# EAGLE design main1 (EAGLE 9.2.2)
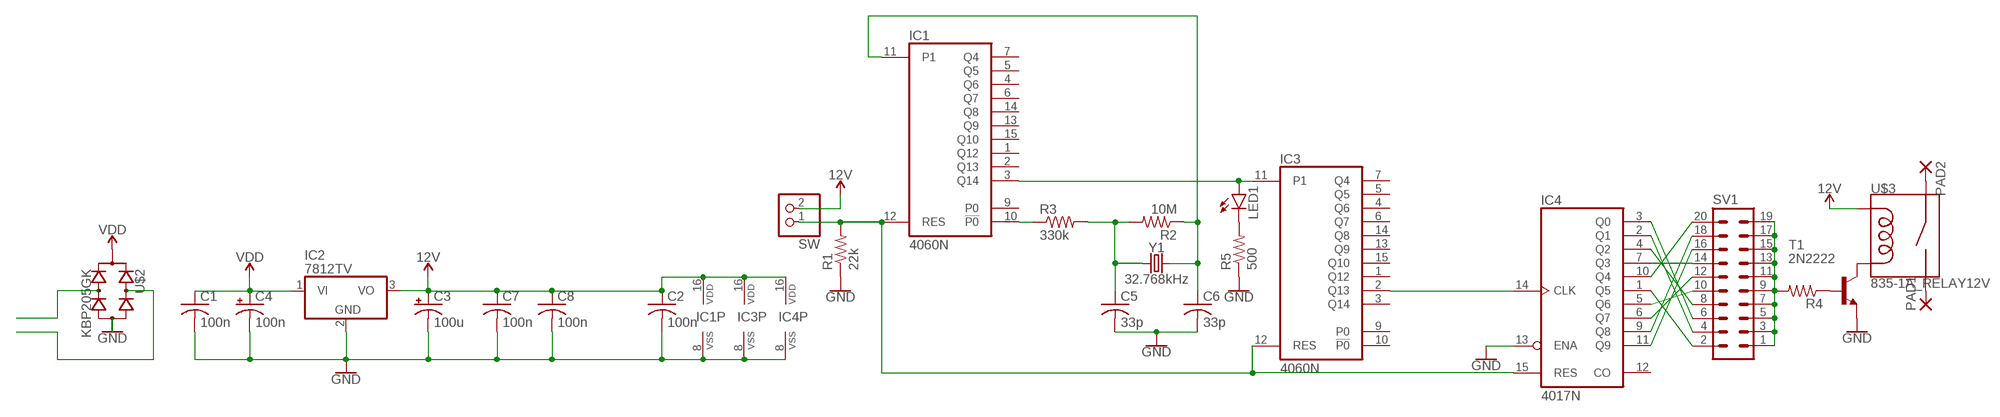
[diagram p0: schematic, sheet 1]

## Parts
C1  100n  C-US025-025X050  [C025-025X050]
C2  100n  C-US025-025X050  [C025-025X050]
C3  100u  CPOL-USE2-5  [E2-5]
C4  100n  CPOL-USE2-5  [E2-5]
C5  33p  C-US025-025X050  [C025-025X050]
C6  33p  C-US025-025X050  [C025-025X050]
C7  100n  C-US025-025X050  [C025-025X050]
C8  100n  C-US025-025X050  [C025-025X050]
IC1  4060N  [DIL16]
IC2  7812TV  [TO220V]
IC3  4060N  [DIL16]
IC4  4017N  [DIL16]
LED1  LED3MM  [LED3MM]
PAD1  2,54/1,0  [2,54/1,0]
PAD2  2,54/1,0  [2,54/1,0]
R1  22k  R-US_0207/7  [0207/7]
R2  10M  R-US_0207/7  [0207/7]
R3  330k  R-US_0207/7  [0207/7]
R4  R-US_0207/2V  [0207/2V]
R5  500  R-US_0207/7  [0207/7]
SV1  MA10-2  [MA10-2]
SW  PINHD-1X2  [1X02]
T1  2N2222  [TO92-EBC-OVAL]
U$2  KBP205GK  [KBP205G]
U$3  835-1A_RELAY12V  [835-1A_RELAY_12V]
Y1  32.768kHz  CRYSTAL-32.768KHZPTH-2X6  [CRYSTAL-PTH-2X6-CYL]

## Nets
12V: C2.1 C3.+ C7.1 C8.1 IC1.16(VDD) IC2.3(VO) IC3.16(VDD) IC4.16(VDD) SW.2 U$3.P$1(COIL1)
GND: C1.2 C2.2 C3.- C4.- C5.2 C6.2 C7.2 C8.2 IC1.8(VSS) IC2.2(GND) IC3.8(VSS) IC4.8(VSS) IC4.13(ENA) R1.1 R5.1 T1.E U$2.-
N$1: U$2.AC@2(AC)
N$2: U$2.AC@1(AC)
N$3: IC1.12(RES) IC3.12(RES) IC4.15(RES) R1.2 SW.1
N$4: IC1.10(!P0) R3.1
N$5: C6.1 IC1.11(P1) R2.1 Y1.2
N$6: IC1.3(Q14) IC3.11(P1) LED1.A
N$7: C5.1 R2.2 R3.2 Y1.1
N$8: IC3.2(Q13) IC4.14(CLK)
N$9: IC4.11(Q9) SV1.16
N$10: IC4.9(Q8) SV1.18
N$11: IC4.6(Q7) SV1.12
N$12: IC4.5(Q6) SV1.10
N$13: IC4.1(Q5) SV1.2
N$14: IC4.10(Q4) SV1.20
N$15: IC4.7(Q3) SV1.14
N$16: IC4.4(Q2) SV1.8
N$17: IC4.2(Q1) SV1.4
N$18: IC4.3(Q0) SV1.6
N$19: R4.2 SV1.1 SV1.3 SV1.5 SV1.7 SV1.9 SV1.11 SV1.13 SV1.15 SV1.17 SV1.19
N$20: R4.1 T1.B
N$21: T1.C U$3.P$2(COIL2)
N$22: LED1.K(C) R5.2
N$23: PAD1.1(P) U$3.P$4(NO)
N$24: PAD2.1(P) U$3.P$3(MAIN)
VDD: C1.1 C4.+ IC2.1(VI) U$2.+
Unconnected: IC1.1(Q12) IC1.2(Q13) IC1.4(Q6) IC1.5(Q5) IC1.6(Q7) IC1.7(Q4) IC1.9(P0) IC1.13(Q9) IC1.14(Q8) IC1.15(Q10) IC3.1(Q12) IC3.3(Q14) IC3.4(Q6) IC3.5(Q5) IC3.6(Q7) IC3.7(Q4) IC3.9(P0) IC3.10(!P0) IC3.13(Q9) IC3.14(Q8) IC3.15(Q10) IC4.12(CO)

## Library data of the parts
C1 C2 C5-C8 = rcl:C-US: CAPACITOR, American symbol; SPICEPREFIX: C
C3 C4 = rcl:CPOL-US: POLARIZED CAPACITOR, American symbol; SPICEPREFIX: C
IC1 IC3 = 40xx:4060: 14-stage binary/ripple COUNTER
IC2 = linear:78*: Positive VOLTAGE REGULATOR Source: http://cache.national.com/ds/LM/LM78L05.pdf http://www.fairchildsemi.com/ds/LM/LM7805.pdf
IC4 = 40xx:4017: COUNTER/DIVIDER
LED1 = led:LED: LED OSRAM: - CHIPLED LG R971, LG N971, LY N971, LG Q971, LY Q971, LO R971, LY R971 LH N974, LH R974 LS Q976, LO Q976, LY Q976 LO Q996 - Hyper CHIPLED LW Q18S LB Q993, LB Q99A, LB R99A - SideLED LS A670, LO A670, LY A670, LG A670, LP A670 LB A673, LV A673, LT A673, LW A673 LH A674 LY A675 LS A676, LA A676, LO A676, LY A676, LW A676 LS A679, LY A679, LG A679 - Hyper Micro SIDELED® LS Y876, LA Y876, LO Y876, LY Y876 LT Y87S - SmartLED LW L88C, LW L88S LB L89C, LB L89S, LG L890 LS L89K, LO L89K, LY L89K LS L896, LA L896, LO L896, LY L896 - TOPLED LS T670, LO T670, LY T670, LG T670, LP T670 LSG T670, LSP T670, LSY T670, LOP T670, LYG T670 LG T671, LOG T671, LSG T671 LB T673, LV T673, LT T673, LW T673 LH T674 LS T676, LA T676, LO T676, LY T676, LB T676, LH T676, LSB T676, LW T676 LB T67C, LV T67C, LT T67C, LS T67K, LO T67K, LY T67K, LW E67C LS E67B, LA E67B, LO E67B, LY E67B, LB E67C, LV E67C, LT E67C LW T67C LS T679, LY T679, LG T679 LS T770, LO T770, LY T770, LG T770, LP T770 LB T773, LV T773, LT T773, LW T773 LH T774 LS E675, LA E675, LY E675, LS T675 LS T776, LA T776, LO T776, LY T776, LB T776 LHGB T686 LT T68C, LB T68C - Hyper Mini TOPLED® LB M676 - Mini TOPLED Santana® LG M470 LS M47K, LO M47K, LY M47K Source: http://www.osram.convergy.de LUXEON: - LUMILED® LXK2-PW12-R00, LXK2-PW12-S00, LXK2-PW14-U00, LXK2-PW14-V00 LXK2-PM12-R00, LXK2-PM12-S00, LXK2-PM14-U00 LXK2-PE12-Q00, LXK2-PE12-R00, LXK2-PE12-S00, LXK2-PE14-T00, LXK2-PE14-U00 LXK2-PB12-K00, LXK2-PB12-L00, LXK2-PB12-M00, LXK2-PB14-N00, LXK2-PB14-P00, LXK2-PB14-Q00 LXK2-PR12-L00, LXK2-PR12-M00, LXK2-PR14-Q00, LXK2-PR14-R00 LXK2-PD12-Q00, LXK2-PD12-R00, LXK2-PD12-S00 LXK2-PH12-R00, LXK2-PH12-S00 LXK2-PL12-P00, LXK2-PL12-Q00, LXK2-PL12-R00 Source: www.luxeon.com KINGBRIGHT: KA-3528ASYC Source: www.kingbright.com
PAD1 PAD2 = 7_segment_lib:2,54/1,0: THROUGH-HOLE PAD
R1-R5 = rcl:R-US_: RESISTOR, American symbol; SPICEPREFIX: R
SV1 = con-lstb:MA10-2: PIN HEADER; OC_FARNELL: unknown; OC_NEWARK: unknown
SW = pinhead:PINHD-1X2: PIN HEADER
T1 = adafruit:2N2222: NPN TRANSISTOR Big oval pads
U$2 = 7_segment_lib:KBP205G
U$3 = 7_segment_lib:835-1A_RELAY12V
Y1 = SparkFun-Clocks:CRYSTAL-32.768KHZ: 32.768kHz Crystal Frequency: 32.768kHz Frequency Stability: ±20ppm Load Capacitance: 12.5pF (PTH-2X6 & SMD-3.2X1.5), 6pF (SMD-2X6) SparkFun Products: SparkFun BigTime Watch Kit <https://www.sparkfun.com/products/11734> SparkFun nRF52832 Breakout <https://www.sparkfun.com/products/13990> SparkFun Real Time Clock Module <https://www.sparkfun.com/products/12708>; PROD_ID: XTAL-10112

## Board
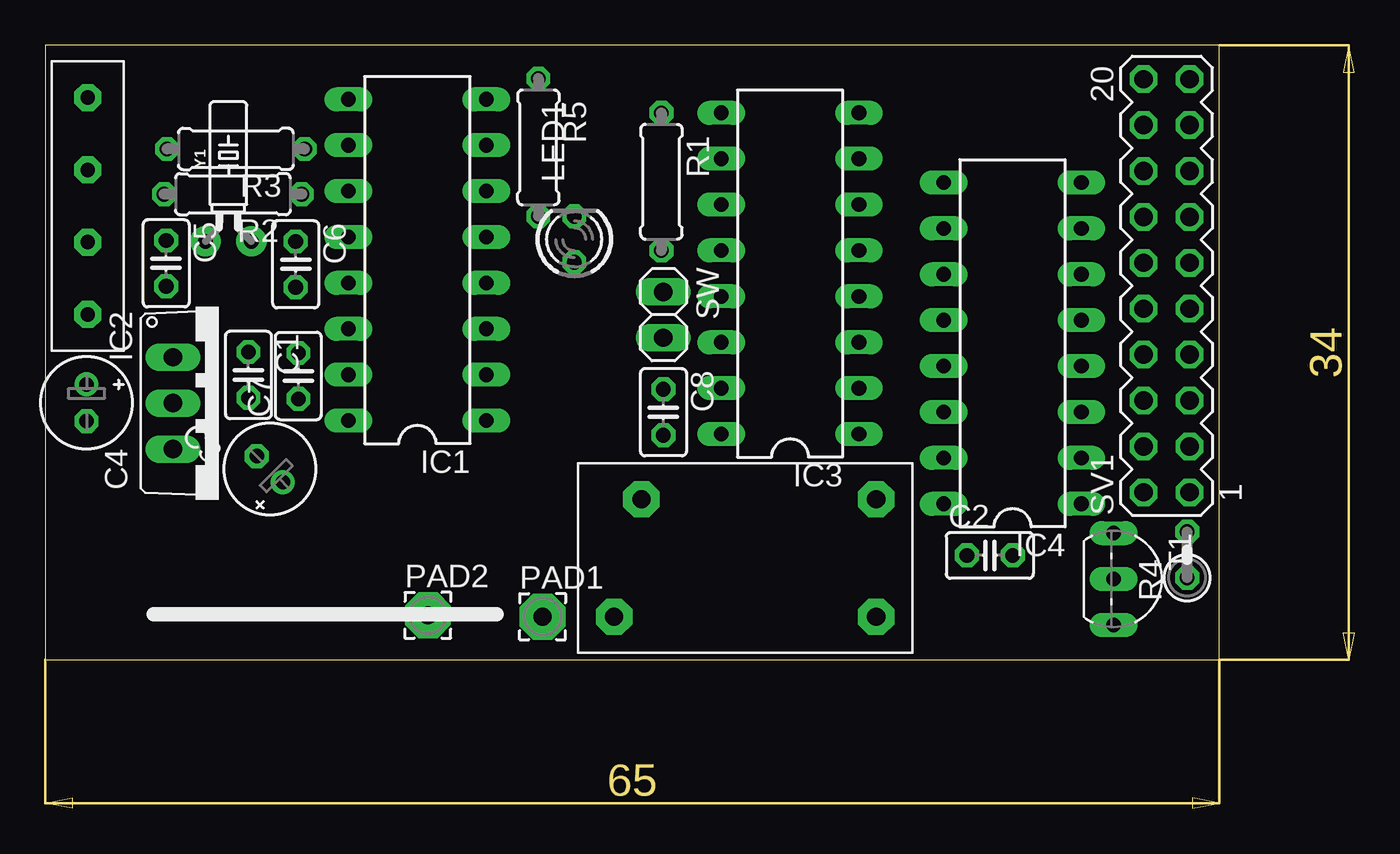
[diagram p1: board, top side]
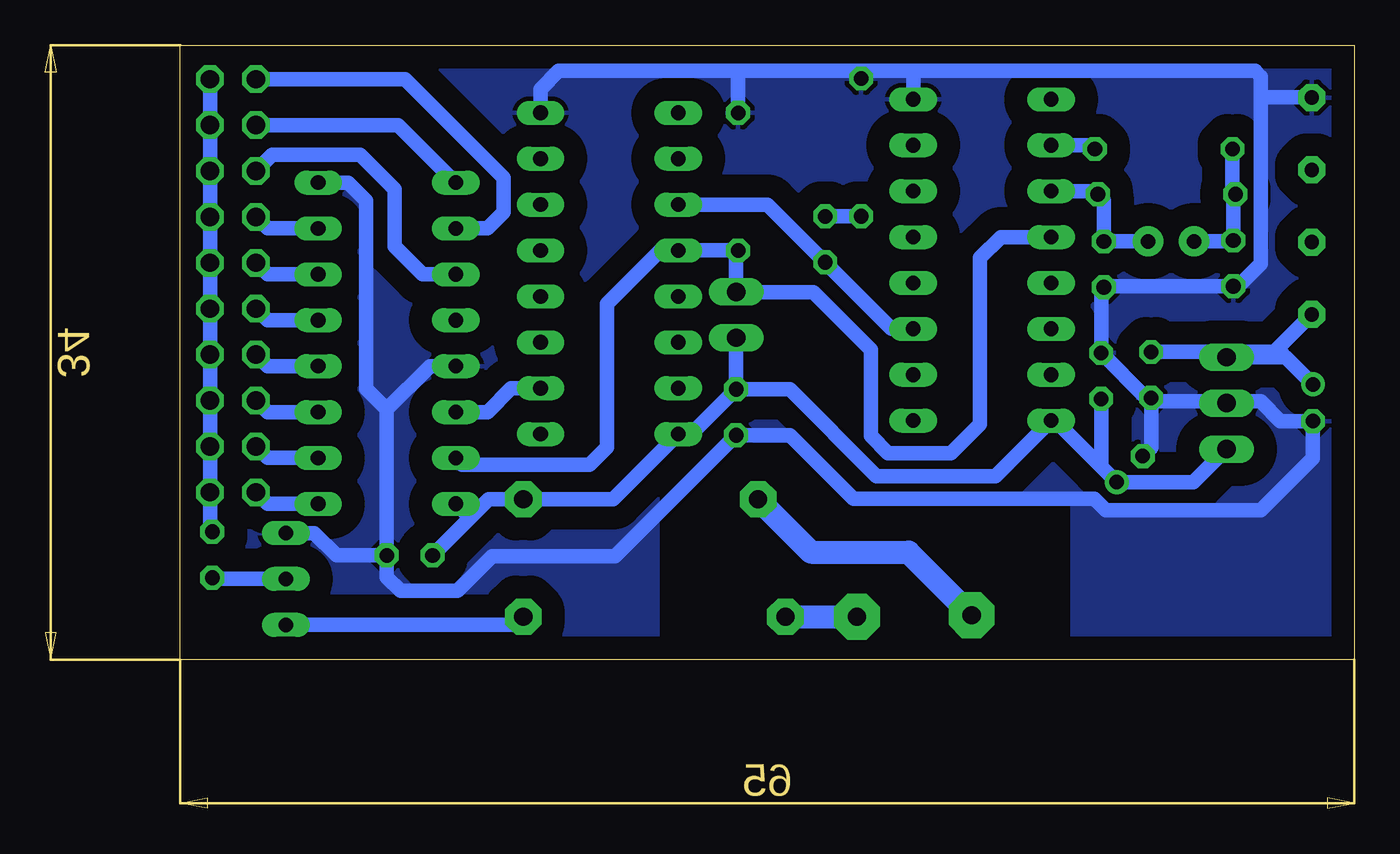
[diagram p2: board, bottom side, seen from below]

Size 65 x 34 mm. Coordinates in mm from the lower left corner, seen from the top.
Outline: 0,0 65,0 65,34 0,34 0,0
Copper layers (1*16): Top 0.035mm / dielectric 1.5mm / Bottom 0.035mm
Design rules "default": minimum track width 6mil, minimum drill 0.35mm, track to track 6mil, track to pad 6mil, pad to pad 6mil, via to via 6mil, smd to smd 6mil, copper to edge 40mil, drill to drill 6mil, minimum pad ring 10mil, minimum via ring 8mil, stop-mask expansion 4mil, vias tented up to drill 0mil, thermal gap 10mil

### Footprints (pad centres in the part's own frame; a part is rotated, then mirrored left to right if it is on the bottom)
C025-025X050 = drill 0.813 octagon: 1 -1.27,0; 2 1.27,0
E2-5 = drill 0.813 pad 1.27: + -1.016,0 | drill 0.813 pad 1.27 octagon: - 1.016,0
DIL16 = drill 0.813 long: 1 -8.89,-3.81; 2 -6.35,-3.81; 3 -3.81,-3.81; 4 -1.27,-3.81; 5 1.27,-3.81; 6 3.81,-3.81; 7 6.35,-3.81; 8 8.89,-3.81; 9 8.89,3.81; 10 6.35,3.81; 11 3.81,3.81; 12 1.27,3.81; 13 -1.27,3.81; 14 -3.81,3.81; 15 -6.35,3.81; 16 -8.89,3.81
TO220V = drill 1.016 long: 1 -2.54,-2.54; 2 0,-2.54; 3 2.54,-2.54
LED3MM = drill 0.813 octagon: A -1.27,0; K 1.27,0
2,54/1,0 = drill 1.016 pad 2.54 octagon: 1 0,0
0207/7 = drill 0.813 octagon: 1 -3.81,0; 2 3.81,0
0207/2V = drill 0.813 octagon: 1 -1.27,0; 2 1.27,0
MA10-2 = drill 1.016 octagon: 1 -11.43,-1.27; 2 -11.43,1.27; 3 -8.89,-1.27; 4 -8.89,1.27; 5 -6.35,-1.27; 6 -6.35,1.27; 7 -3.81,-1.27; 8 -3.81,1.27; 9 -1.27,-1.27; 10 -1.27,1.27; 11 1.27,-1.27; 12 1.27,1.27; 13 3.81,-1.27; 14 3.81,1.27; 15 6.35,-1.27; 16 6.35,1.27; 17 8.89,-1.27; 18 8.89,1.27; 19 11.43,-1.27; 20 11.43,1.27
1X02 = drill 1.016 long: 1 -1.27,0; 2 1.27,0
TO92-EBC-OVAL = drill 0.813 long: B 0,-1.27; C 2.54,-1.27; E -2.54,-1.27
KBP205G = drill 0.8 pad 1.5 octagon: + 0,0; - 12,0; AC@1 4,0; AC@2 8,0
835-1A_RELAY_12V = drill 1 pad 2 octagon: P$1 8.5,2; P$2 2,2; P$3 8.5,15; P$4 2,16.5
CRYSTAL-PTH-2X6-CYL = drill 0.813 pad 1.676: 1 -1.27,0; 2 1.27,0

### Placement (x,y rotation side)
C1  11.25,15.75 270 top
C2  52.29,5.77 0 top
C3  12.43,10.54 135 top
C4  2.29,14.21 270 top
C5  6.7,21.93 270 top
C6  13.87,21.87 270 top
C7  14.01,15.7 90 top
C8  34.22,13.69 270 top
IC1  20.6,22.11 90 top
IC2  9.62,14.19 270 top
IC3  41.23,21.37 90 top
IC4  53.55,17.51 90 top
LED1  29.29,23.25 90 top
PAD1  27.54,2.38 0 top
PAD2  21.19,2.46 0 top
R1  34.11,26.45 270 top
R2  10.39,25.75 180 top
R3  10.55,28.25 180 top
R4  63.22,5.8 90 top
R5  27.3,28.34 270 top
SV1  62.08,20.69 90 top
SW  34.22,19.08 270 top
T1  60.41,4.46 270 top
U$2  2.35,19.1 90 top
U$3  48,0.37 90 top
Y1  10.14,23.14 0 top

### Tracks (layer width: path | path; a pad name or v marks a point on that pad's centre or on a via)
12V
  Bottom 0.813: 48.92,7.87 47.92,8.87 U$3.P$1 41.04,8.87 IC3.16 36.71,12.48 C8.1 | 48.92,7.87 C2.1 | IC4.16 48.99,7.87 48.92,7.87 | SW.2 34.22,14.97 C8.1 | IC2.3 8.9,9.82 C3.+ | C3.+ 16.55,13.22 IC1.16 19.86,10.16 26.45,10.16 31.25,14.96 C8.1 | C7.1 14.01,10.69 C3.+
GND
  Bottom 0.813: C2.2 56.35,5.77 57.58,7 T1.E | C2.2 53.56,13.85 | IC4.13 51.17,16.24 53.56,13.85 | IC4.8 55.71,26.4 54.71,25.4 54.71,14.99 53.56,13.85 | C2.2 53.56,4.57 52.8,3.81 49.63,3.81 47.72,5.71 40.94,5.71 34.23,12.42 C8.2 31.25,12.42 27.72,8.89 14.38,8.89 13.75,8.26 5.18,8.26 2.29,11.14 C4.- 4.09,13.2 5.18,14.29 6.98,14.29 | 24.55,32.58 29.62,32.58 31.75,32.58 | 31.75,32.58 27.3,32.58 R5.1 | 31.75,32.58 34.07,32.58 | 34.07,32.58 44.04,32.58 45.05,31.57 IC3.8 | R1.1 34.11,32.54 34.07,32.58 | IC1.8 24.41,32.45 24.55,32.58 | 13.81,20.66 C5.2 6.43,20.66 5.18,21.91 5.18,31.11 | 13.81,20.66 C6.2 | 13.81,20.66 14.01,20.45 C7.2 11.53,14.48 C1.2 | 5.18,31.11 5.18,32.26 5.5,32.58 24.55,32.58 | 6.98,14.29 IC2.2 | C1.2 11.05,14.29 6.98,14.29 | C3.- 11.25,11.72 C1.2 | U$2.- 2.37,31.11 5.18,31.11
  pour Bottom (isolate 1.27): -0.22,34.29 65.19,34.29 65.19,0 38.52,0 38.52,12.06 27.72,12.06 27.72,8.89 15.65,8.89 15.65,0 -0.22,0
N$3
  Bottom 0.813: IC4.15 49.38,10.79 42.33,10.79 41.37,11.75 41.37,19.68 38.42,22.64 IC3.12 34.34,22.64 34.22,22.52 | 34.22,22.52 SW.1 34.19,20.32 29.94,20.32 26.77,17.14 26.77,12.38 25.82,11.43 22.32,11.43 20.73,13.02 20.73,22.23 19.58,23.39 IC1.12 | 34.22,22.52 R1.2
N$4
  Bottom 0.813: IC1.10 14.57,28.46 R3.1
N$5
  Bottom 0.813: IC1.11 14.37,25.93 | 14.37,25.93 R2.1 | Y1.2 C6.1 13.87,25.42 14.37,25.93
N$6
  Bottom 0.813: IC1.3 25.61,18.3 LED1.A 32.49,25.18 IC3.11
N$7
  Bottom 0.813: R3.2 6.74,25.91 R2.2 6.7,25.64 C5.1 6.75,23.14 Y1.1
N$8
  Bottom 0.813: IC4.14 47.99,13.7 46.67,15.02 IC3.2
N$9
  Bottom 0.813: IC4.11 51.58,21.32 53.12,22.86 53.12,26.04 55.02,27.94 59.9,27.94 SV1.16
N$10
  Bottom 0.813: SV1.18 52.92,29.58 IC4.9
N$11
  Bottom 0.813: IC4.6 60.17,21.32 SV1.12
N$12
  Bottom 0.813: SV1.10 60.17,18.78 IC4.5
N$13
  Bottom 0.813: SV1.2 60.17,8.62 IC4.1
N$14
  Bottom 0.813: IC4.10 47.99,23.86 47.09,24.77 47.09,26.67 52.54,32.12 SV1.20
N$15
  Bottom 0.813: IC4.7 60.17,23.86 SV1.14
N$16
  Bottom 0.813: SV1.8 60.17,16.24 IC4.4
N$17
  Bottom 0.813: SV1.4 60.17,11.16 IC4.2
N$18
  Bottom 0.813: SV1.6 60.17,13.7 IC4.3
N$19
  Bottom 0.813: 63.34,14 SV1.3 SV1.1 63.34,7.2 R4.2 | 63.34,14 63.34,17 | 63.34,17 63.34,19 | 63.34,19 63.34,22 | 63.34,22 63.34,25 | 63.34,25 63.34,27 | 63.34,27 63.34,30 | 63.34,30 SV1.19 | SV1.17 63.34,30 | SV1.15 63.34,27 | SV1.13 63.34,25 | SV1.11 63.34,22 | SV1.9 63.34,19 | SV1.7 63.34,17 | SV1.5 63.34,14
N$20
  Bottom 0.813: T1.B 63.15,4.46 R4.1
N$21
  Bottom 0.813: T1.C 46.45,1.92 U$3.P$2
N$22
  Bottom 0.813: R5.2 29.28,24.54 LED1.K
N$23
  Bottom 1.27: U$3.P$4 PAD1.1
N$24
  Bottom 1.27: U$3.P$3 30.08,5.95 24.68,5.95 PAD2.1
VDD
  Bottom 0.813: C1.1 4.43,17.02 | 4.43,17.02 U$2.+ | C4.+ 3.79,16.73 | 3.79,16.73 IC2.1 | 3.79,16.73 4.08,17.02 4.43,17.02